# EasyEDA Pro project STM Embedded BD.eprj, board PCB1
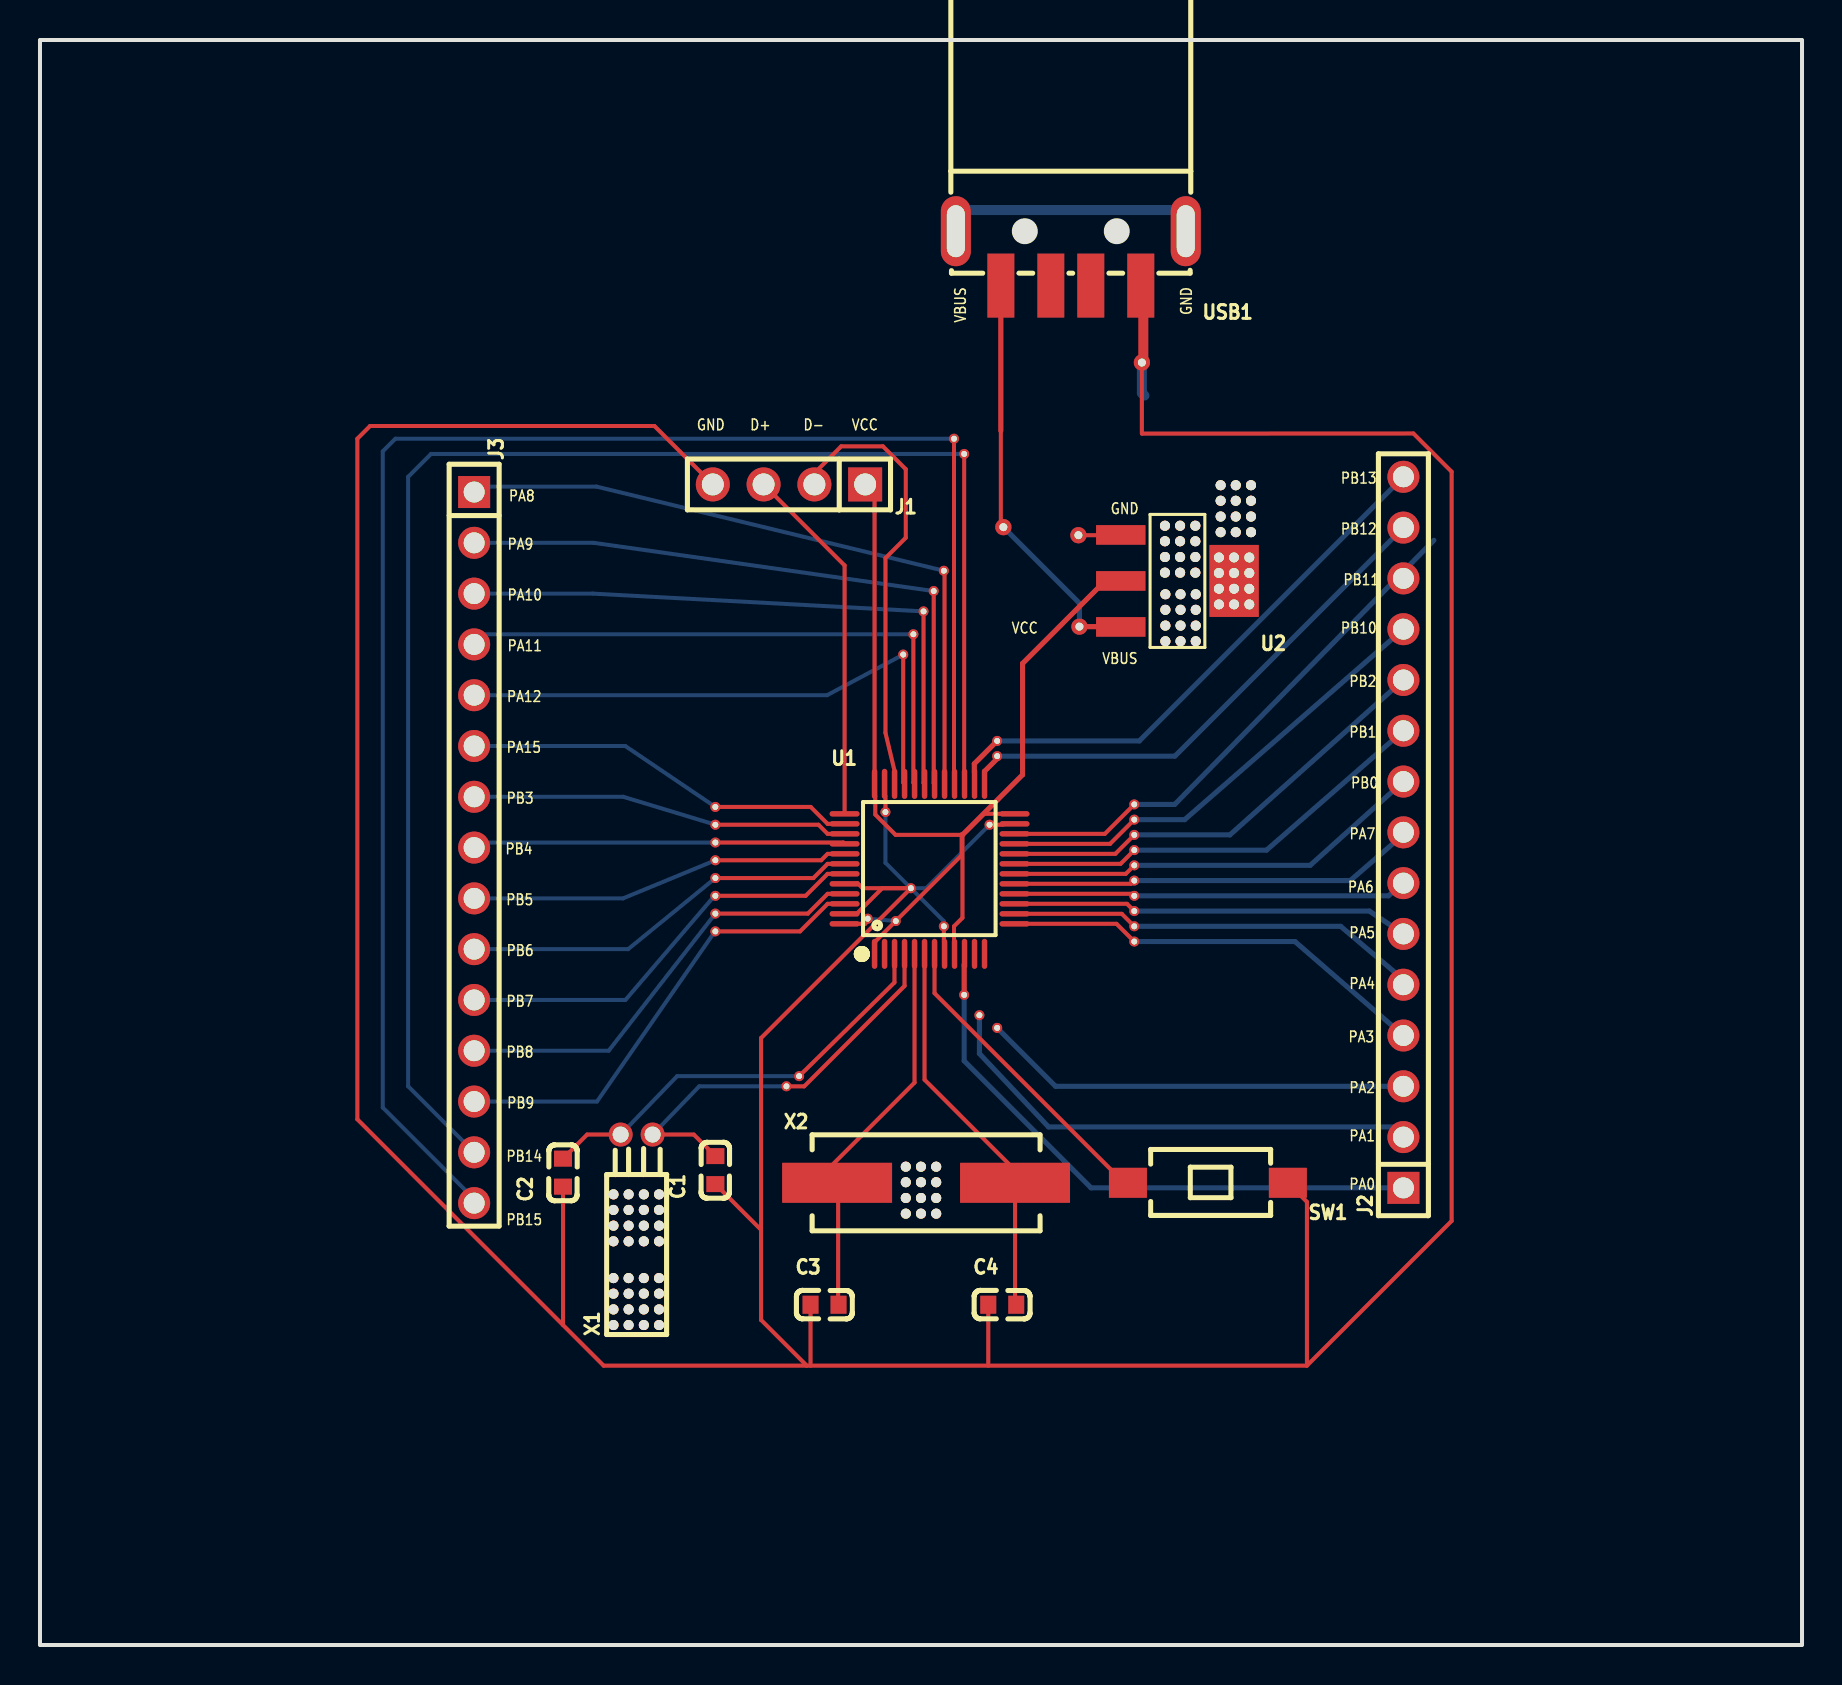
[diagram p2: board, top side]
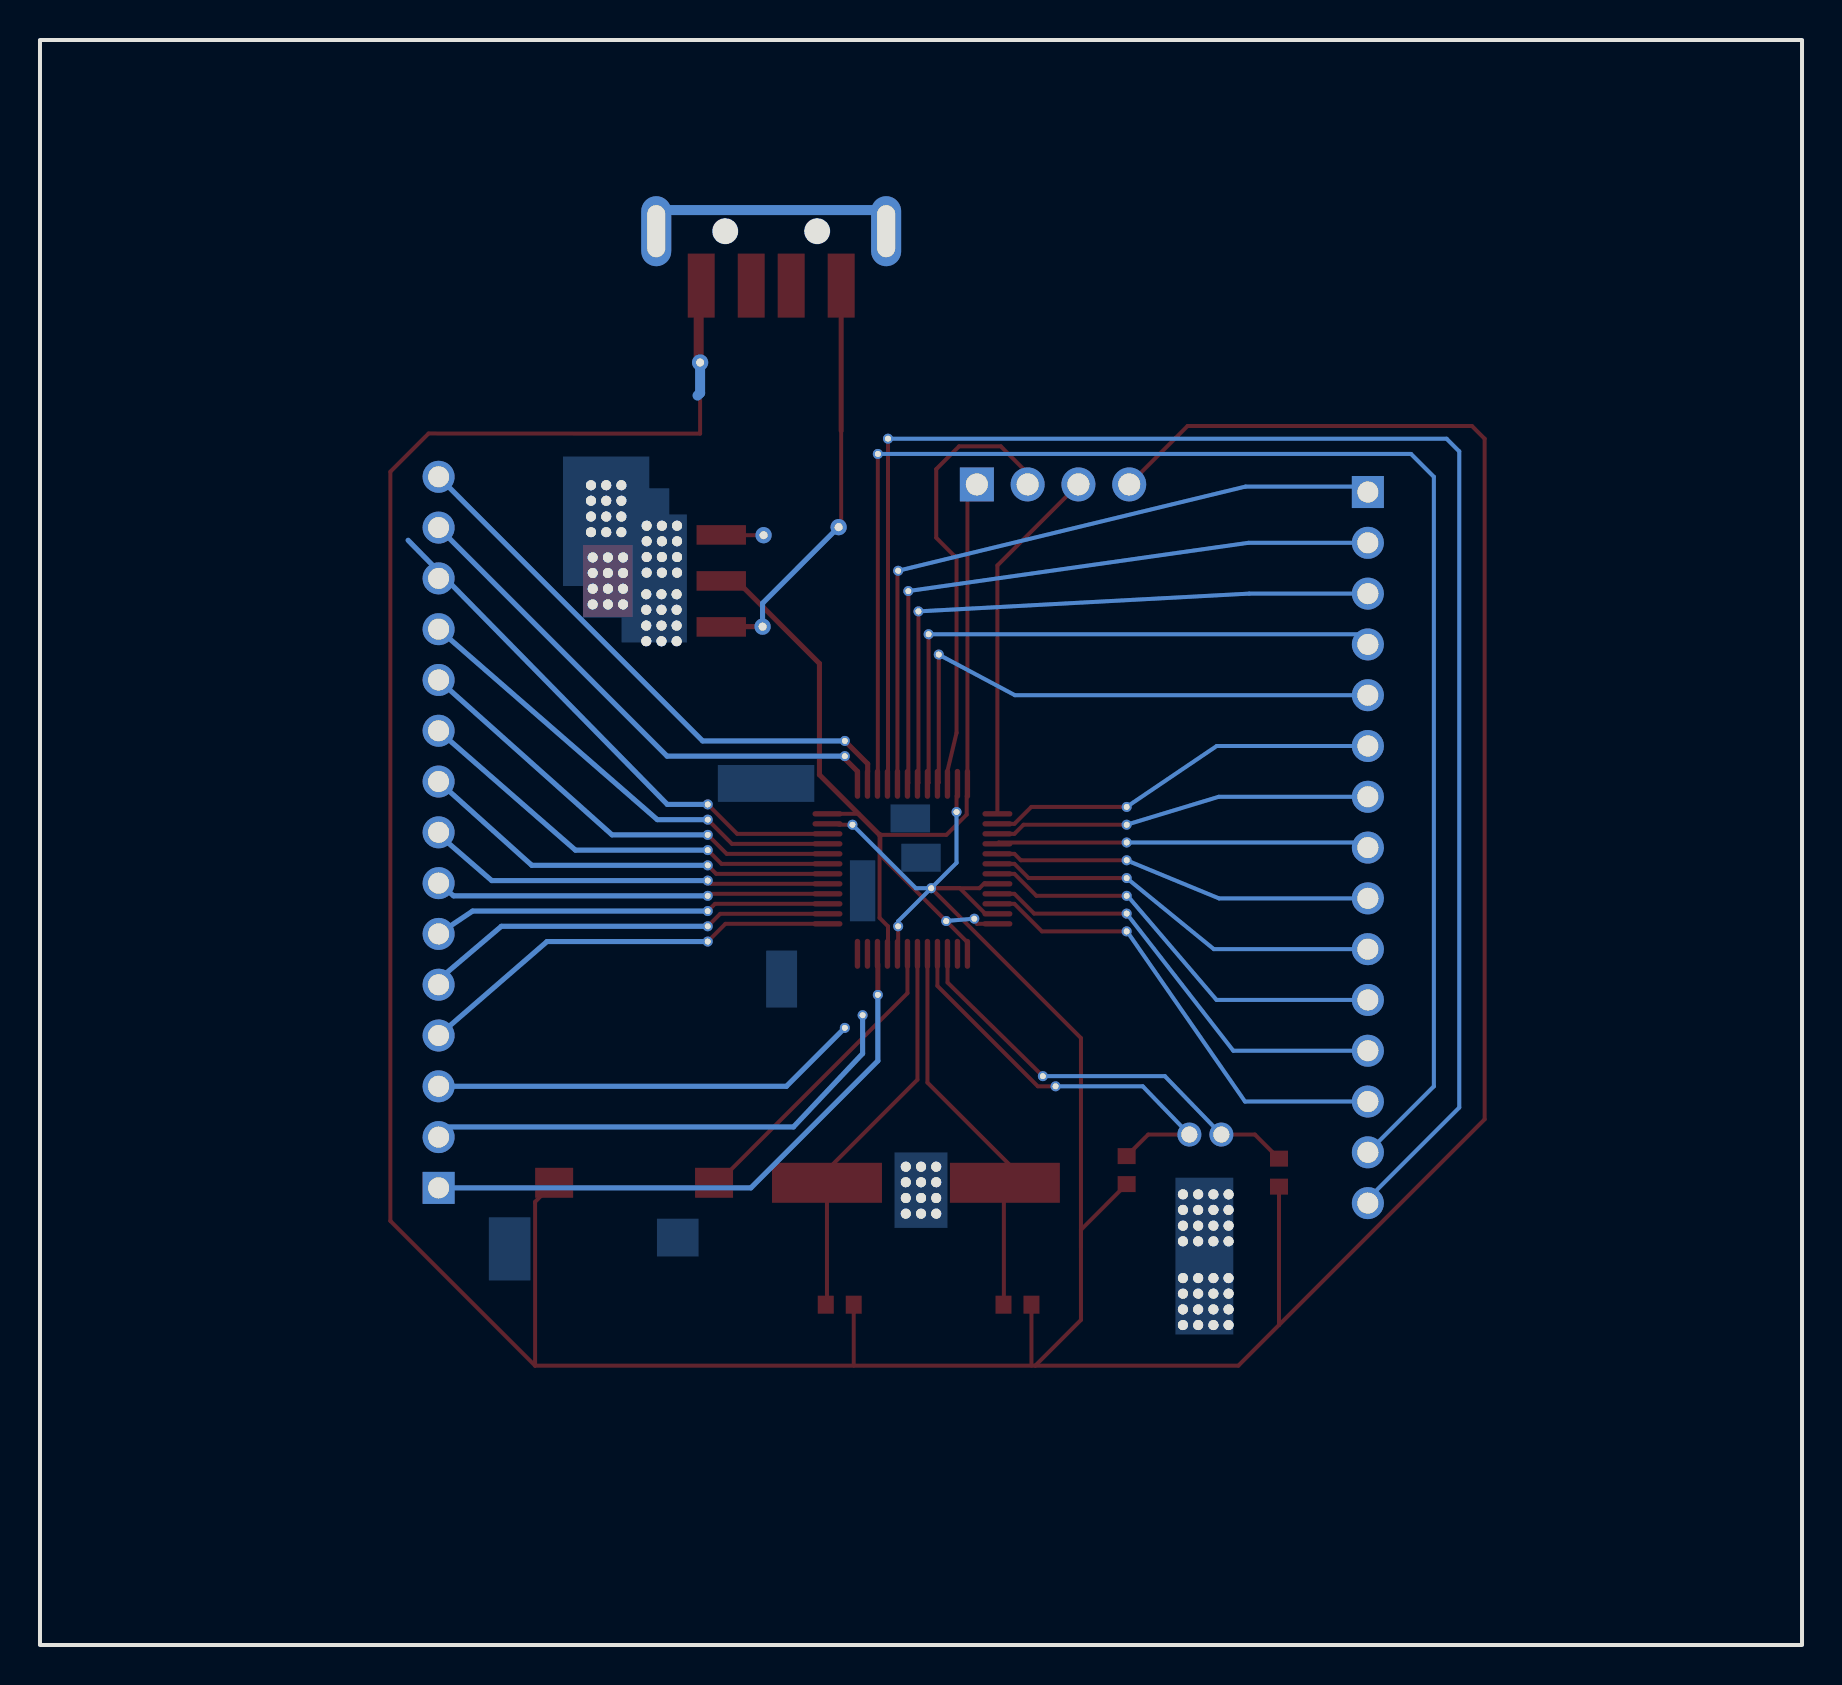
[diagram p3: board, bottom side, seen from below]

Outline 88.14 x 80.26 mm; copper layers: Top Layer, Bottom Layer. Coordinates in mm from the lower left corner of the outline.
Outline path: rectangle 0,80.26 88.14,0
Stack: Top Layer 0.035mm / Dielectric1 1.51mm FR4 er 4.5 / Bottom Layer 0.035mm

## Design rules (mm)
template: JLCPCB Capability(Two Layers Board)
spacing copperThickness1oz (default): track to track 0.102, other pairs 0.152 to 0.3
spacing copperThickness2oz: track to track 0.203, other pairs 0.152 to 0.3
track width copperThickness1oz (default): min 0.127, default 0.254, max 2.54
track width copperThickness2oz: min 0.203, default 0.254, max 2.54
differential pair differentialPair (default): width min 0.127, default 0.254, max 2.54; gap min 0.152, default 0.152
via viaSize (default): diameter min 0.5, default 0.61, max 10; hole min 0.3, default 0.305, max 6.3

## Placement (name value [footprint] x y rotation side)
C1  22pF  [C0603]  33.78 23.75 90 top
C2  22pF  [C0603]  26.16 23.62 90 top
C3  22pF  [C0603]  39.24 17.02 0 top
C4  22pF  [C0603]  48.13 17.02 0 top
J1  PZ254V-11-04P  [HDR-TH_4P-P2.54-V-M]  37.47 58.04 180 top
J2  PZ254-1-15-Z-8.5  [HDR-TH_15P-P2.54-V-M]  68.2 40.64 90 top
J3  PZ254-1-15-Z-8.5  [HDR-TH_15P-P2.54-V-M]  21.72 39.88 270 top
NOREF  -  [Pad_e101]  51.94 55.5 0 top
NOREF#2  -  [Pad_e408]  59.81 57.22 0 top
NOREF#3  -  [Pad_e334]  30.97 17.57 0 top
NOREF#4  -  [Pad_e138]  30.21 20.97 0 top
NOREF#5  -  [Pad_e198]  29.44 18.35 0 top
NOREF#6  -  [Pad_e392]  56.29 52.55 0 top
NOREF#7  -  [Pad_e426]  44.07 21.57 0 top
NOREF#8  -  [Pad_e113]  33.78 41.02 0 top
NOREF#9  -  [Pad_e207]  42.81 36.2 0 top
NOREF#10  -  [Pad_e418]  60.49 54.39 0 top
NOREF#11  -  [Pad_e428]  43.31 23.92 0 top
NOREF#12  -  [Pad_e48]  54.74 36.7 0 top
NOREF#13  -  [Pad_e394]  57.81 52.55 0 top
NOREF#14  -  [Pad_e371]  57.79 55.2 0 top
NOREF#15  -  [Pad_e400]  57.81 51.77 0 top
NOREF#16  -  [Pad_e182]  42.29 41.66 0 top
NOREF#17  -  [Pad_e201]  28.69 17.57 0 top
NOREF#18  -  [Pad_e427]  44.83 21.57 0 top
NOREF#19  -  [Pad_e26]  47.88 45.21 0 top
NOREF#20  -  [Pad_e46]  54.74 38.23 0 top
NOREF#21  -  [Pad_e359]  57.79 55.97 0 top
NOREF#22  -  [Pad_e421]  58.97 52.82 0 top
NOREF#23  -  [Pad_e430]  44.83 23.92 0 top
NOREF#24  -  [Pad_e137]  29.44 20.97 0 top
NOREF#25  -  [Pad_e196]  30.97 16 0 top
NOREF#26  -  [Pad_e420]  59.73 53.61 0 top
NOREF#27  -  [Pad_e44]  54.74 38.99 0 top
NOREF#28  -  [Pad_e218]  37.34 27.94 0 top
NOREF#29  -  [Pad_e369]  57.79 54.41 0 top
NOREF#30  -  [Pad_e199]  30.21 18.35 0 top
NOREF#31  -  [Pad_e342]  57.03 53.63 0 top
NOREF#32  -  [Pad_e49]  54.74 35.94 0 top
NOREF#33  -  [Pad_e115]  33.78 39.24 0 top
NOREF#34  -  [Pad_e193]  28.69 16 0 top
NOREF#35  -  [Pad_e42]  54.74 40.51 0 top
NOREF#36  -  [Pad_e36]  54.74 42.04 0 top
NOREF#37  -  [Pad_e391]  57.81 50.2 0 top
NOREF#38  -  [Pad_e407]  59.06 57.22 0 top
NOREF#39  -  [Pad_e131]  30.21 21.76 0 top
NOREF#40  -  [Pad_e424]  60.49 53.61 0 top
NOREF#41  -  [Pad_e402]  59.81 55.65 0 top
NOREF#42  -  [Pad_e366]  57.03 55.2 0 top
NOREF#43  -  [Pad_e206]  41.4 36.32 0 top
NOREF#44  -  [Pad_e41]  54.74 41.27 0 top
NOREF#45  -  [Pad_e142]  30.21 20.19 0 top
NOREF#46  -  [Pad_e18]  51.99 50.93 0 top
NOREF#47  -  [Pad_e425]  43.31 21.57 0 top
NOREF#48  -  [Pad_e107]  45.21 53.72 0 top
NOREF#49  -  [Pad_e117]  33.78 37.46 0 top
NOREF#50  -  [Pad_e132]  30.97 21.76 0 top
NOREF#51  -  [Pad_e50]  54.74 35.18 0 top
NOREF#52  -  [Pad_e353]  56.27 55.97 0 top
NOREF#53  -  [Pad_e47]  54.74 37.46 0 top
NOREF#54  -  [Pad_e395]  56.29 51.77 0 top
NOREF#55  -  [Pad_e413]  58.97 52.04 0 top
NOREF#56  -  [Pad_e112]  33.78 41.91 0 top
NOREF#57  -  [Pad_e100]  28.69 21.76 0 top
NOREF#58  -  [Pad_e108]  44.7 52.7 0 top
NOREF#59  -  [Pad_e210]  29.44 17.57 0 top
NOREF#60  -  [Pad_e419]  58.97 53.61 0 top
NOREF#61  -  [Pad_e71]  29.44 22.54 0 top
NOREF#62  -  [Pad_e434]  44.07 22.35 0 top
NOREF#63  -  [Pad_e436]  44.83 23.14 0 top
NOREF#64  -  [Pad_e414]  59.73 52.04 0 top
NOREF#65  -  [Pad_e399]  57.81 50.98 0 top
NOREF#66  -  [Pad_e404]  59.06 58 0 top
NOREF#67  -  [Pad_e130]  29.44 21.76 0 top
NOREF#68  -  [Pad_e195]  30.21 16 0 top
NOREF#69  -  [Pad_e64]  46.99 31.5 0 top
NOREF#70  -  [Pad_e269]  30.97 16.78 0 top
NOREF#71  -  [Pad_e246]  30.21 16.78 0 top
NOREF#72  -  [Pad_e416]  58.97 54.39 0 top
NOREF#73  -  [Pad_e133]  28.69 20.97 0 top
NOREF#74  -  [Pad_e15]  48.19 55.9 0 top
NOREF#75  -  [Pad_e346]  57.79 53.63 0 top
NOREF#76  -  [Pad_e410]  59.81 56.43 0 top
NOREF#77  -  [Pad_e184]  43.56 37.85 0 top
NOREF#78  -  [Pad_e435]  44.83 22.35 0 top
NOREF#79  -  [Pad_e431]  43.31 23.14 0 top
NOREF#80  -  [Pad_e417]  59.73 54.39 0 top
NOREF#81  -  [Pad_e397]  56.29 50.98 0 top
NOREF#82  -  [Pad_e28]  47.88 44.45 0 top
NOREF#83  -  [Pad_e114]  33.78 40.13 0 top
NOREF#84  -  [Pad_e398]  57.05 50.98 0 top
NOREF#85  -  [Pad_e396]  57.05 51.77 0 top
NOREF#86  -  [Pad_e405]  59.81 58 0 top
NOREF#87  -  [Pad_e200]  30.97 18.35 0 top
NOREF#88  -  [Pad_e409]  59.06 56.43 0 top
NOREF#89  -  [Pad_e226]  28.69 16.78 0 top
NOREF#90  -  [Pad_e401]  59.06 55.65 0 top
NOREF#91  -  [Pad_e183]  47.5 41.02 0 top
NOREF#92  -  [Pad_e180]  45.21 35.94 0 top
NOREF#93  -  [Pad_e98]  30.21 22.54 0 top
NOREF#94  -  [Pad_e110]  43.69 50.55 0 top
NOREF#95  -  [Pad_e45]  54.74 39.75 0 top
NOREF#96  -  [Pad_e116]  33.78 38.35 0 top
NOREF#97  -  [Pad_e390]  57.05 50.2 0 top
NOREF#98  -  [Pad_e393]  57.05 52.55 0 top
NOREF#99  -  [Pad_e429]  44.07 23.92 0 top
NOREF#100  -  [Pad_e217]  37.97 28.45 0 top
NOREF#101  -  [Pad_e65]  46.23 32.51 0 top
NOREF#102  -  [Pad_e365]  56.27 55.2 0 top
NOREF#103  -  [Pad_e412]  60.58 57.22 0 top
NOREF#104  -  [Pad_e228]  29.44 16.78 0 top
NOREF#105  -  [Pad_e403]  60.58 55.65 0 top
NOREF#106  -  [Pad_e111]  43.18 49.53 0 top
NOREF#107  -  [Pad_e63]  47.88 30.86 0 top
NOREF#108  -  [Pad_e194]  29.44 16 0 top
NOREF#109  -  [Pad_e272]  30.21 17.57 0 top
NOREF#110  -  [Pad_e367]  56.27 54.41 0 top
NOREF#111  -  [Pad_e140]  28.69 20.19 0 top
NOREF#112  -  [Pad_e164]  46.23 59.56 0 top
NOREF#113  -  [Pad_e109]  44.2 51.69 0 top
NOREF#114  -  [Pad_e338]  56.27 53.63 0 top
NOREF#115  -  [Pad_e415]  60.49 52.04 0 top
NOREF#116  -  [Pad_e356]  57.03 55.97 0 top
NOREF#117  -  [Pad_e433]  43.31 22.35 0 top
NOREF#118  -  [Pad_e143]  30.97 20.19 0 top
NOREF#119  -  [Pad_e99]  30.97 22.54 0 top
NOREF#120  -  [Pad_e70]  28.69 22.54 0 top
NOREF#121  -  [Pad_e422]  59.73 52.82 0 top
NOREF#122  -  [Pad_e406]  60.58 58 0 top
NOREF#123  -  [Pad_e389]  56.29 50.2 0 top
NOREF#124  -  [Pad_e411]  60.58 56.43 0 top
NOREF#125  -  [Pad_e197]  28.69 18.35 0 top
NOREF#126  -  [Pad_e163]  45.72 60.32 0 top
NOREF#127  -  [Pad_e432]  44.07 23.14 0 top
NOREF#128  -  [Pad_e141]  29.44 20.19 0 top
NOREF#129  -  [Pad_e423]  60.49 52.82 0 top
NOREF#130  -  [Pad_e102]  55.12 64.13 0 top
NOREF#131  -  [Pad_e139]  30.97 20.97 0 top
NOREF#132  -  [Pad_e368]  57.03 54.41 0 top
NOREF#133  -  [Pad_e119]  33.78 35.69 0 top
NOREF#134  -  [Pad_e118]  33.78 36.58 0 top
SW1  TS-1101-C-W  [SW-SMD_L6.0-W3.3-LS8.0]  58.42 23.11 180 top
U1  STM32F103C8T6  [LQFP-48_L7.0-W7.0-P0.50-LS9.0-BL]  44.5 38.81 0 top
U2  AMS1117-3.3  [SOT-223-4_L6.5-W3.5-P2.30-LS7.0-BR]  56.9 53.21 180 top
USB1  AM 180°  [USB-SMD_AM180]  51.56 69.34 180 top
X1  32.768kHz  [OSC-TH_BD3.1-P0.8-D0.3]  29.84 25.53 90 top
X2  8MHz  [CRYSTAL-SMD_L11.5-W4.8-LS12.7]  44.32 23.11 0 top

## Footprints (pads in the part's own frame, mm; a bottom-side part is the same pattern mirrored in y, then rotated)
C0603
  rect 0.8x0.9 smd: 1(-0.7,0) 2(0.7,0)
CRYSTAL-SMD_L11.5-W4.8-LS12.7
  rect 5.5x2 smd: 1(-4.45,0) 2(4.45,0)
HDR-TH_4P-P2.54-V-M
  rect 1.7x1.7 hole 1.1: 1(-3.81,0)
  round 1.7 hole 1.1: 2(-1.27,0) 3(1.27,0) 4(3.81,0)
HDR-TH_15P-P2.54-V-M
  rect 1.6x1.6 hole 1.05: 1(-17.78,0)
  round 1.6 hole 1.05: 2(-15.24,0) 3(-12.7,0) 4(-10.16,0) 5(-7.62,0) 6(-5.08,0) 7(-2.54,0) 8(0,0) 9(2.54,0) 10(5.08,0) 11(7.62,0) 12(10.16,0) 13(12.7,0) 14(15.24,0) 15(17.78,0)
LQFP-48_L7.0-W7.0-P0.50-LS9.0-BL
  oval 0.27x1.5 smd: 1(-2.75,-4.25) 2(-2.25,-4.25) 3(-1.75,-4.25) 4(-1.25,-4.25) 5(-0.75,-4.25) 6(-0.25,-4.25) 7(0.25,-4.25) 8(0.75,-4.25) 9(1.25,-4.25) 10(1.75,-4.25) 11(2.25,-4.25) 12(2.75,-4.25) 25(2.75,4.25) 26(2.25,4.25) 27(1.75,4.25) 28(1.25,4.25) 29(0.75,4.25) 30(0.25,4.25) 31(-0.25,4.25) 32(-0.75,4.25) 33(-1.25,4.25) 34(-1.75,4.25) 35(-2.25,4.25) 36(-2.75,4.25)
  oval 1.5x0.27 smd: 13(4.25,-2.75) 14(4.25,-2.25) 15(4.25,-1.75) 16(4.25,-1.25) 17(4.25,-0.75) 18(4.25,-0.25) 19(4.25,0.25) 20(4.25,0.75) 21(4.25,1.25) 22(4.25,1.75) 23(4.25,2.25) 24(4.25,2.75) 37(-4.25,2.75) 38(-4.25,2.25) 39(-4.25,1.75) 40(-4.25,1.25) 41(-4.25,0.75) 42(-4.25,0.25) 43(-4.25,-0.25) 44(-4.25,-0.75) 45(-4.25,-1.25) 46(-4.25,-1.75) 47(-4.25,-2.25) 48(-4.25,-2.75)
OSC-TH_BD3.1-P0.8-D0.3
  round 1.2 hole 0.8: 1(0,0.8) 2(0,-0.8)
Pad_e15
  round 0.813 hole 0.4: 49(0,0)
Pad_e18
  round 0.813 hole 0.4: 50(0,0)
Pad_e26
  round 0.5 hole 0.3: 51(0,0)
Pad_e28
  round 0.5 hole 0.3: 51(0,0)
Pad_e36
  round 0.5 hole 0.3: 52(0,0)
Pad_e41
  round 0.5 hole 0.3: 52(0,0)
Pad_e42
  round 0.5 hole 0.3: 52(0,0)
Pad_e44
  round 0.5 hole 0.3: 52(0,0)
Pad_e45
  round 0.5 hole 0.3: 52(0,0)
Pad_e46
  round 0.5 hole 0.3: 52(0,0)
Pad_e47
  round 0.5 hole 0.3: 52(0,0)
Pad_e48
  round 0.5 hole 0.3: 52(0,0)
Pad_e49
  round 0.5 hole 0.3: 52(0,0)
Pad_e50
  round 0.5 hole 0.3: 52(0,0)
Pad_e63
  round 0.5 hole 0.3: 52(0,0)
Pad_e64
  round 0.5 hole 0.3: 53(0,0)
Pad_e65
  round 0.5 hole 0.3: 54(0,0)
Pad_e70
  round 0.5 hole 0.5: 47(0,0)
Pad_e71
  round 0.5 hole 0.5: 47(0,0)
Pad_e98
  round 0.5 hole 0.5: 47(0,0)
Pad_e99
  round 0.5 hole 0.5: 47(0,0)
Pad_e100
  round 0.5 hole 0.5: 47(0,0)
Pad_e101
  round 0.813 hole 0.4: 49(0,0)
Pad_e102
  round 0.813 hole 0.4: 49(0,0)
Pad_e107
  round 0.5 hole 0.3: 55(0,0)
Pad_e108
  round 0.5 hole 0.3: 56(0,0)
Pad_e109
  round 0.5 hole 0.3: 57(0,0)
Pad_e110
  round 0.5 hole 0.3: 58(0,0)
Pad_e111
  round 0.5 hole 0.3: 59(0,0)
Pad_e112
  round 0.5 hole 0.3: 60(0,0)
Pad_e113
  round 0.5 hole 0.3: 61(0,0)
Pad_e114
  round 0.5 hole 0.3: 62(0,0)
Pad_e115
  round 0.5 hole 0.3: 63(0,0)
Pad_e116
  round 0.5 hole 0.3: 64(0,0)
Pad_e117
  round 0.5 hole 0.3: 65(0,0)
Pad_e118
  round 0.5 hole 0.3: 66(0,0)
Pad_e119
  round 0.5 hole 0.3: 67(0,0)
Pad_e130
  round 0.5 hole 0.5: 47(0,0)
Pad_e131
  round 0.5 hole 0.5: 47(0,0)
Pad_e132
  round 0.5 hole 0.5: 47(0,0)
Pad_e133
  round 0.5 hole 0.5: 47(0,0)
Pad_e137
  round 0.5 hole 0.5: 47(0,0)
Pad_e138
  round 0.5 hole 0.5: 47(0,0)
Pad_e139
  round 0.5 hole 0.5: 47(0,0)
Pad_e140
  round 0.5 hole 0.5: 47(0,0)
Pad_e141
  round 0.5 hole 0.5: 47(0,0)
Pad_e142
  round 0.5 hole 0.5: 47(0,0)
Pad_e143
  round 0.5 hole 0.5: 47(0,0)
Pad_e163
  round 0.5 hole 0.3: 68(0,0)
Pad_e164
  round 0.5 hole 0.3: 69(0,0)
Pad_e180
  round 0.5 hole 0.3: 70(0,0)
Pad_e182
  round 0.5 hole 0.3: 72(0,0)
Pad_e183
  round 0.5 hole 0.3: 73(0,0)
Pad_e184
  round 0.5 hole 0.3: 74(0,0)
Pad_e193
  round 0.5 hole 0.5: 47(0,0)
Pad_e194
  round 0.5 hole 0.5: 47(0,0)
Pad_e195
  round 0.5 hole 0.5: 47(0,0)
Pad_e196
  round 0.5 hole 0.5: 47(0,0)
Pad_e197
  round 0.5 hole 0.5: 47(0,0)
Pad_e198
  round 0.5 hole 0.5: 47(0,0)
Pad_e199
  round 0.5 hole 0.5: 47(0,0)
Pad_e200
  round 0.5 hole 0.5: 47(0,0)
Pad_e201
  round 0.5 hole 0.5: 47(0,0)
Pad_e206
  round 0.5 hole 0.3: 71(0,0)
Pad_e207
  round 0.5 hole 0.3: 75(0,0)
Pad_e210
  round 0.5 hole 0.5: 47(0,0)
Pad_e217
  round 0.5 hole 0.3: 76(0,0)
Pad_e218
  round 0.5 hole 0.3: 77(0,0)
Pad_e226
  round 0.5 hole 0.5: 47(0,0)
Pad_e228
  round 0.5 hole 0.5: 47(0,0)
Pad_e246
  round 0.5 hole 0.5: 47(0,0)
Pad_e269
  round 0.5 hole 0.5: 47(0,0)
Pad_e272
  round 0.5 hole 0.5: 47(0,0)
Pad_e334
  round 0.5 hole 0.5: 47(0,0)
Pad_e338
  round 0.5 hole 0.5: 47(0,0)
Pad_e342
  round 0.5 hole 0.5: 47(0,0)
Pad_e346
  round 0.5 hole 0.5: 47(0,0)
Pad_e353
  round 0.5 hole 0.5: 47(0,0)
Pad_e356
  round 0.5 hole 0.5: 47(0,0)
Pad_e359
  round 0.5 hole 0.5: 47(0,0)
Pad_e365
  round 0.5 hole 0.5: 47(0,0)
Pad_e366
  round 0.5 hole 0.5: 47(0,0)
Pad_e367
  round 0.5 hole 0.5: 47(0,0)
Pad_e368
  round 0.5 hole 0.5: 47(0,0)
Pad_e369
  round 0.5 hole 0.5: 47(0,0)
Pad_e371
  round 0.5 hole 0.5: 47(0,0)
Pad_e389
  round 0.5 hole 0.5: 47(0,0)
Pad_e390
  round 0.5 hole 0.5: 47(0,0)
Pad_e391
  round 0.5 hole 0.5: 47(0,0)
Pad_e392
  round 0.5 hole 0.5: 47(0,0)
Pad_e393
  round 0.5 hole 0.5: 47(0,0)
Pad_e394
  round 0.5 hole 0.5: 47(0,0)
Pad_e395
  round 0.5 hole 0.5: 47(0,0)
Pad_e396
  round 0.5 hole 0.5: 47(0,0)
Pad_e397
  round 0.5 hole 0.5: 47(0,0)
Pad_e398
  round 0.5 hole 0.5: 47(0,0)
Pad_e399
  round 0.5 hole 0.5: 47(0,0)
Pad_e400
  round 0.5 hole 0.5: 47(0,0)
Pad_e401
  round 0.5 hole 0.5: 47(0,0)
Pad_e402
  round 0.5 hole 0.5: 47(0,0)
Pad_e403
  round 0.5 hole 0.5: 47(0,0)
Pad_e404
  round 0.5 hole 0.5: 47(0,0)
Pad_e405
  round 0.5 hole 0.5: 47(0,0)
Pad_e406
  round 0.5 hole 0.5: 47(0,0)
Pad_e407
  round 0.5 hole 0.5: 47(0,0)
Pad_e408
  round 0.5 hole 0.5: 47(0,0)
Pad_e409
  round 0.5 hole 0.5: 47(0,0)
Pad_e410
  round 0.5 hole 0.5: 47(0,0)
Pad_e411
  round 0.5 hole 0.5: 47(0,0)
Pad_e412
  round 0.5 hole 0.5: 47(0,0)
Pad_e413
  round 0.5 hole 0.5: 47(0,0)
Pad_e414
  round 0.5 hole 0.5: 47(0,0)
Pad_e415
  round 0.5 hole 0.5: 47(0,0)
Pad_e416
  round 0.5 hole 0.5: 47(0,0)
Pad_e417
  round 0.5 hole 0.5: 47(0,0)
Pad_e418
  round 0.5 hole 0.5: 47(0,0)
Pad_e419
  round 0.5 hole 0.5: 47(0,0)
Pad_e420
  round 0.5 hole 0.5: 47(0,0)
Pad_e421
  round 0.5 hole 0.5: 47(0,0)
Pad_e422
  round 0.5 hole 0.5: 47(0,0)
Pad_e423
  round 0.5 hole 0.5: 47(0,0)
Pad_e424
  round 0.5 hole 0.5: 47(0,0)
Pad_e425
  round 0.5 hole 0.5: 47(0,0)
Pad_e426
  round 0.5 hole 0.5: 47(0,0)
Pad_e427
  round 0.5 hole 0.5: 47(0,0)
Pad_e428
  round 0.5 hole 0.5: 47(0,0)
Pad_e429
  round 0.5 hole 0.5: 47(0,0)
Pad_e430
  round 0.5 hole 0.5: 47(0,0)
Pad_e431
  round 0.5 hole 0.5: 47(0,0)
Pad_e432
  round 0.5 hole 0.5: 47(0,0)
Pad_e433
  round 0.5 hole 0.5: 47(0,0)
Pad_e434
  round 0.5 hole 0.5: 47(0,0)
Pad_e435
  round 0.5 hole 0.5: 47(0,0)
Pad_e436
  round 0.5 hole 0.5: 47(0,0)
SOT-223-4_L6.5-W3.5-P2.30-LS7.0-BR
  rect 2.47x0.98 smd: 1(2.835,-2.3) 2(2.835,0) 3(2.835,2.3)
  rect 2.47x3.6 smd: 4(-2.835,0)
SW-SMD_L6.0-W3.3-LS8.0
  rect 1.9x1.5 smd: 1(-4,0) 2(4,0)
USB-SMD_AM180
  rect 1.35x3.2 smd: 1(3.5,1.36) 2(1,1.36) 3(-1,1.36) 4(-3.5,1.36)
  oval 1.5x3.5 hole 0.9x2.6: 5(-5.75,-1.36) 5(5.75,-1.36)

## Nets
GND: C1.1 C2.1 C3.1 C4.1 J1.4 NOREF.49 NOREF#2.47 NOREF#3.47 NOREF#4.47 NOREF#5.47 NOREF#6.47 NOREF#7.47 NOREF#10.47 NOREF#11.47 NOREF#13.47 NOREF#14.47 NOREF#15.47 NOREF#16.72 NOREF#17.47 NOREF#18.47 NOREF#21.47 NOREF#22.47 NOREF#23.47 NOREF#24.47 NOREF#25.47 NOREF#26.47 NOREF#29.47 NOREF#30.47 NOREF#31.47 NOREF#34.47 NOREF#37.47 NOREF#38.47 NOREF#39.47 NOREF#40.47 NOREF#41.47 NOREF#42.47 NOREF#45.47 NOREF#47.47 NOREF#50.47 NOREF#52.47 NOREF#54.47 NOREF#55.47 NOREF#57.47 NOREF#59.47 NOREF#60.47 NOREF#61.47 NOREF#62.47 NOREF#63.47 NOREF#64.47 NOREF#65.47 NOREF#66.47 NOREF#67.47 NOREF#68.47 NOREF#70.47 NOREF#71.47 NOREF#72.47 NOREF#73.47 NOREF#75.47 NOREF#76.47 NOREF#77.74 NOREF#78.47 NOREF#79.47 NOREF#80.47 NOREF#81.47 NOREF#84.47 NOREF#85.47 NOREF#86.47 NOREF#87.47 NOREF#88.47 NOREF#89.47 NOREF#90.47 NOREF#91.73 NOREF#92.70 NOREF#93.47 NOREF#97.47 NOREF#98.47 NOREF#99.47 NOREF#102.47 NOREF#103.47 NOREF#104.47 NOREF#105.47 NOREF#108.47 NOREF#109.47 NOREF#110.47 NOREF#111.47 NOREF#114.47 NOREF#115.47 NOREF#116.47 NOREF#117.47 NOREF#118.47 NOREF#119.47 NOREF#120.47 NOREF#121.47 NOREF#122.47 NOREF#123.47 NOREF#124.47 NOREF#125.47 NOREF#127.47 NOREF#128.47 NOREF#129.47 NOREF#130.49 NOREF#131.47 NOREF#132.47 SW1.1 U1.8 U1.23 U1.35 U1.44 U1.47 U2.1 USB1.4
VCC: J1.1 NOREF#9.75 NOREF#43.71 U1.1 U1.9 U1.24 U1.36 U1.48 U2.2
NC: U1.2
$3N746: NOREF#46.50 NOREF#74.49 U2.3 USB1.1
$3N1161: J1.3 U1.37
$3N1166: J1.2 U1.34
$3N1666: C2.2 NOREF#100.76 U1.3 X1.1
$3N1672: C1.2 NOREF#28.77 U1.4 X1.2
$3N1678: C3.2 U1.5 X2.1
$3N1684: C4.2 U1.6 X2.2
$3N2120: SW1.2 U1.7
$3N2429: J2.1 NOREF#101.54 U1.10
$3N2434: J2.2 NOREF#69.53 U1.11
$3N2444: J2.3 NOREF#107.52 U1.12
$3N2454: J2.4 NOREF#51.52 U1.13
$3N2466: J2.5 NOREF#32.52 U1.14
$3N2478: J2.6 NOREF#12.52 U1.15
$3N2490: J2.7 NOREF#53.52 U1.16
$3N2502: J2.8 NOREF#20.52 U1.17
$3N2512: J2.9 NOREF#27.52 U1.18
$3N2522: J2.10 NOREF#95.52 U1.19
$3N2532: J2.11 NOREF#35.52 U1.20
$3N2544: J2.12 NOREF#44.52 U1.21
$3N2554: J2.13 NOREF#36.52 U1.22
$3N2566: J2.14 NOREF#82.51 U1.25
$3N2574: J2.15 NOREF#19.51 U1.26
$3N2672: J3.1 NOREF#48.55 U1.29
$3N2687: J3.2 NOREF#58.56 U1.30
$3N2690: J3.3 NOREF#113.57 U1.31
$3N2693: J3.4 NOREF#94.58 U1.32
$3N2713: J3.5 NOREF#106.59 U1.33
$3N2720: J3.6 NOREF#56.60 U1.38
$3N2725: J3.7 NOREF#8.61 U1.39
$3N2730: J3.8 NOREF#83.62 U1.40
$3N2735: J3.9 NOREF#33.63 U1.41
$3N2740: J3.10 NOREF#96.64 U1.42
$3N2746: J3.11 NOREF#49.65 U1.43
$3N2751: J3.12 NOREF#134.66 U1.45
$3N2756: J3.13 NOREF#133.67 U1.46
$3N2761: J3.14 NOREF#112.69 U1.27
$3N2768: J3.15 NOREF#126.68 U1.28

Pads without a net: U2 4; USB1 2 3 5

## Routing (per net, layer and track width the routed paths; a pad name or vN(x,y) marks a point on that pad's centre or on a via; arc(x,y) is an arc through that point)
$3N2672: length 10.7
  Top Layer w0.2: U1.29 45.25,53.69 NOREF#48.55
$3N2687: length 9.7
  Top Layer w0.2: NOREF#58.56 44.7,43.11 U1.30
$3N2690: length 8.6
  Top Layer w0.2: NOREF#113.57 44.2,43.12 U1.31
$3N2693: length 7.5
  Top Layer w0.2: NOREF#94.58 43.69,43.12 U1.32
$3N2713: length 6.5
  Top Layer w0.2: NOREF#106.59 43.18,43.13 U1.33
$3N2720: length 6.8
  Top Layer w0.2: U1.38 39.4,41.06 38.55,41.91 NOREF#56.60
$3N2725: length 6.7
  Top Layer w0.2: NOREF#8.61 38.94,41.02 39.4,40.56 U1.39
$3N2730: length 6.5
  Top Layer w0.2: NOREF#83.62 40.18,40.13 U1.40
$3N2735: length 6.6
  Top Layer w0.2: U1.41 39.4,39.56 39.08,39.24 NOREF#33.63
$3N2740: length 6.8
  Top Layer w0.2: U1.42 39.4,39.06 38.69,38.35 NOREF#96.64
$3N2746: length 6.9
  Top Layer w0.2: U1.43 39.4,38.56 38.3,37.46 NOREF#49.65
$3N2751: length 6.9
  Top Layer w0.2: U1.45 39.4,37.56 38.41,36.58 NOREF#134.66
$3N2756: length 7
  Top Layer w0.2: NOREF#133.67 38.02,35.69 39.4,37.06 U1.46
$3N1161: length 18.2
  Top Layer w0.2: J1.3 40.25,53.99 U1.37
$3N1166: length 21.7
  Top Layer w0.2: J1.2 38.74,58.6 40.08,59.94 42.16,59.94 43.31,58.8 43.31,55.37 42.29,54.36 42.29,45.61 42.75,43.71
$3N1678: length 18.7
  Top Layer w0.2: X2.1 39.92,23.06 39.92,17.28 ; U1.5 43.75,28.13 39.24,23.62
$3N1684: length 18.5
  Top Layer w0.2: U1.6 44.25,28.27 48.51,24 ; X2.2 48.77,17.08 C4.2
$3N2120: length 14.8
  Top Layer w0.2: U1.7 44.75,32.6 53.85,23.49

## Copper pours and planes (outline as drawn; the poured copper is in the pictures)
GND on Bottom Layer: 43.08,40.07 45.06,40.07 45.06,38.67 43.08,38.67
GND on Bottom Layer: 49.4,44.01 54.23,44.01 54.23,42.16 49.4,42.16
GND on Bottom Layer: 63.6,21.39 65.69,21.39 65.69,18.23 63.6,18.23
GND on Bottom Layer: 46.36,39.24 47.62,39.24 47.62,36.19 46.36,36.19
GND on Bottom Layer: 57.66,59.44 61.98,59.44 61.98,52.96 57.66,52.96
GND on Bottom Layer: 42.75,24.63 45.39,24.63 45.39,20.86 42.75,20.86
GND on Bottom Layer: 55.19,21.32 57.28,21.32 57.28,19.43 55.19,19.43
GND on Bottom Layer: 43.61,42.04 45.59,42.04 45.59,40.64 43.61,40.64
GND on Bottom Layer: 55.78,56.54 59.05,56.54 59.05,50.14 55.78,50.14
GND on Bottom Layer: 12.19,63.88 74.42,63.88 74.42,12.19 12.19,12.19
GND on Bottom Layer: 50.27,34.73 51.82,34.73 51.82,31.88 50.27,31.88
GND on Bottom Layer: 28.45,23.37 31.34,23.37 31.34,15.53 28.45,15.53
GND on Bottom Layer: 56.66,57.85 60.98,57.85 60.98,51.37 56.66,51.37

## Text on the board
Top Silkscreen Layer: PB4 | PB5 | PB7 | PB8 | PB14 | PB15 | PA15 | PB3 | PB6 | PA12 | PB9 | PA9 | PA10 | PA11 | PA8 | GND | D+ | D- | VCC | VBUS | PB13 | PB12 | PB10 | PB11 | PA6 | PA3 | PB2 | PB1 | PA5 | PA4 | PA2 | PA1 | PA0 | PA7 | PB0
